# Altium schematic sheet MCU.SchDoc
size A; SheetNumber: 2; SheetTotal: 5
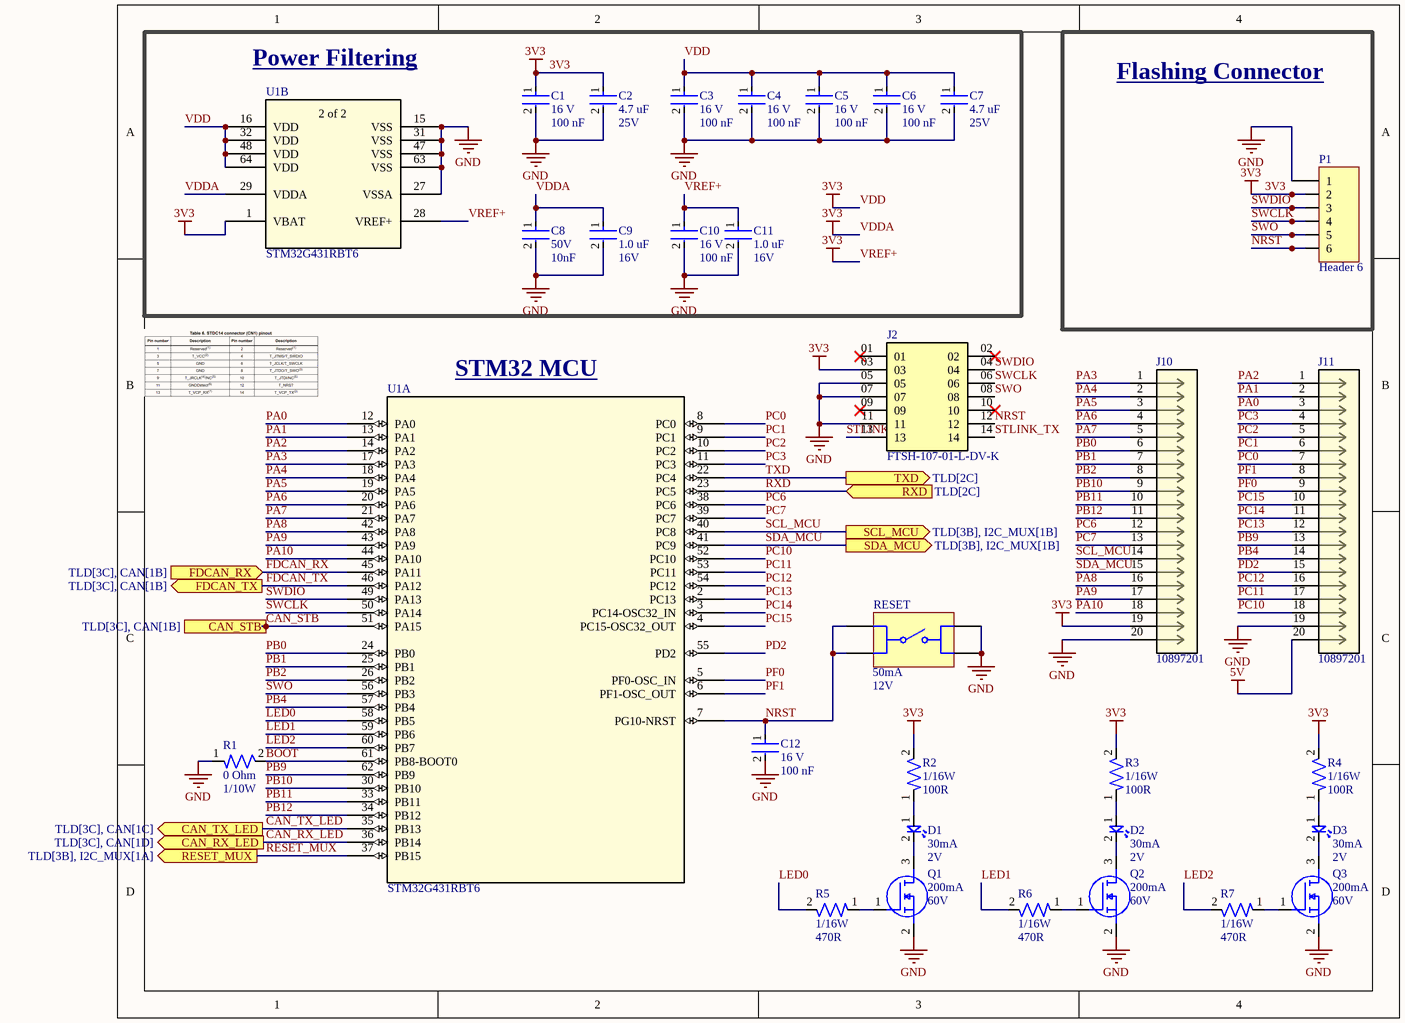
[diagram p0: MCU.SchDoc]

## Parts
C1  Voltage Rating: 16 V  Capacitance: 100 nF  [CAP-0402]  (hidden comment: CC0402KRX7R7BB104)
C2  Capacitance: 4.7 uF  Voltage: 25V  [CAP-0603]  (hidden comment: CC0603KRX5R8BB475)
C3  Voltage Rating: 16 V  Capacitance: 100 nF  [CAP-0402]  (hidden comment: CC0402KRX7R7BB104)
C4  Voltage Rating: 16 V  Capacitance: 100 nF  [CAP-0402]  (hidden comment: CC0402KRX7R7BB104)
C5  Voltage Rating: 16 V  Capacitance: 100 nF  [CAP-0402]  (hidden comment: CC0402KRX7R7BB104)
C6  Voltage Rating: 16 V  Capacitance: 100 nF  [CAP-0402]  (hidden comment: CC0402KRX7R7BB104)
C7  Capacitance: 4.7 uF  Voltage: 25V  [CAP-0603]  (hidden comment: CC0603KRX5R8BB475)
C8  Voltage: 50V  Capacitance: 10nF  [CAP-0805]  (hidden comment: GRM2195C1H103JA01D)
C9  Capacitance: 1.0 uF  Voltage: 16V  [CAP-0603]  (hidden comment: CC0603KRX7R7BB105)
C10  Voltage Rating: 16 V  Capacitance: 100 nF  [CAP-0402]  (hidden comment: CC0402KRX7R7BB104)
C11  Capacitance: 1.0 uF  Voltage: 16V  [CAP-0603]  (hidden comment: CC0603KRX7R7BB105)
C12  Voltage Rating: 16 V  Capacitance: 100 nF  [CAP-0402]  (hidden comment: CC0402KRX7R7BB104)
D1  Forward Current: 30mA  Forward Voltage: 2V  [LED-0603]  (hidden comment: BL-HKC36G-AV-TRB)
D2  Forward Current: 30mA  Forward Voltage: 2V  [LED-0603]  (hidden comment: BL-HKC36G-AV-TRB)
D3  Forward Current: 30mA  Forward Voltage: 2V  [LED-0603]  (hidden comment: BL-HKC36G-AV-TRB)
J2  FTSH-107-01-L-DV-K  [SAMTEC_FTSH-107-01-L-DV-K]
J10  10897201  [CONN20_0010897201_MOL]
J11  10897201  [CONN20_0010897201_MOL]
P1  Header 6  [HDR1X6]
Q1  Continuous Current: 200mA  Voltage: 60V  [IC-SOT23-3]  (hidden comment: T2N7002AK,LM)
Q2  Continuous Current: 200mA  Voltage: 60V  [IC-SOT23-3]  (hidden comment: T2N7002AK,LM)
Q3  Continuous Current: 200mA  Voltage: 60V  [IC-SOT23-3]  (hidden comment: T2N7002AK,LM)
R1  Resistance: 0 Ohm  Power: 1/10W  [RESC1607X60N]  (hidden comment: RESC1607X60N)
R2  Power: 1/16W  Resistance: 100R  [RES-0402]  (hidden comment: RC0402FR-07100RL)
R3  Power: 1/16W  Resistance: 100R  [RES-0402]  (hidden comment: RC0402FR-07100RL)
R4  Power: 1/16W  Resistance: 100R  [RES-0402]  (hidden comment: RC0402FR-07100RL)
R5  Power: 1/16W  Resistance: 470R  [RES-0402]  (hidden comment: RC0402FR-07470RL)
R6  Power: 1/16W  Resistance: 470R  [RES-0402]  (hidden comment: RC0402FR-07470RL)
R7  Power: 1/16W  Resistance: 470R  [RES-0402]  (hidden comment: RC0402FR-07470RL)
RESET  Rated Current: 50mA  Rated Voltage (DC): 12V  [430182095816]  (hidden comment: 430182095816)
U1  STM32G431RBT6  [LQFP64-10x10mm]  (parts A,B of 2)

## Blocks framed on the sheet
Power Filtering: C1-C11 U1
Flashing Connector: P1

## Ports
CAN_RX_LED (out, see TLD[3C], CAN[1D]), CAN_STB (out, see TLD[3C], CAN[1B]), CAN_TX_LED (out, see TLD[3C], CAN[1C]), FDCAN_RX (in, see TLD[3C], CAN[1B]), FDCAN_TX (out, see TLD[3C], CAN[1B]), RESET_MUX (out, see TLD[3B], I2C_MUX[1A]), RXD (in, see TLD[2C]), SCL_MCU (out, see TLD[3B], I2C_MUX[1B]), SDA_MCU (out, see TLD[3B], I2C_MUX[1B]), TXD (out, see TLD[2C])

## Nets
3V3: C1.1 C2.1 C3.1 C4.1 C5.1 C6.1 C7.1 C8.1 C9.1 C10.1 C11.1 J2.03 J10.19 P1.2 R2.2 R3.2 R4.2 U1.1(VBAT) U1.16(VDD) U1.28(VREF+) U1.29(VDDA) U1.32(VDD) U1.48(VDD) U1.64(VDD)  [also labelled VDD, VDDA, VREF+]
5V: J11.20
GND: C1.2 C2.2 C3.2 C4.2 C5.2 C6.2 C7.2 C8.2 C9.2 C10.2 C11.2 C12.2 J2.05 J2.07 J2.11 J10.20 J11.19 P1.1 Q1.2(S) Q2.2(S) Q3.2(S) R1.1 RESET.B1 RESET.B2 U1.15(VSS) U1.27(VSSA) U1.31(VSS) U1.47(VSS) U1.63(VSS)
BOOT: R1.2 U1.61(PB8-BOOT0)
CAN_RX_LED: U1.36(PB14) ; port CAN_RX_LED
CAN_STB: U1.51(PA15) ; port CAN_STB
CAN_TX_LED: U1.35(PB13) ; port CAN_TX_LED
FDCAN_RX: U1.45(PA11) ; port FDCAN_RX
FDCAN_TX: U1.46(PA12) ; port FDCAN_TX
LED0: R5.2 U1.58(PB5)
LED1: R6.2 U1.59(PB6)
LED2: R7.2 U1.60(PB7)
NRST: C12.1 J2.12 P1.6 RESET.A1 RESET.A2 U1.7(PG10-NRST)
PA0: J11.3 U1.12(PA0)
PA1: J11.2 U1.13(PA1)
PA2: J11.1 U1.14(PA2)
PA3: J10.1 U1.17(PA3)
PA4: J10.2 U1.18(PA4)
PA5: J10.3 U1.19(PA5)
PA6: J10.4 U1.20(PA6)
PA7: J10.5 U1.21(PA7)
PA8: J10.16 U1.42(PA8)
PA9: J10.17 U1.43(PA9)
PA10: J10.18 U1.44(PA10)
PB0: J10.6 U1.24(PB0)
PB1: J10.7 U1.25(PB1)
PB2: J10.8 U1.26(PB2)
PB4: J11.14 U1.57(PB4)
PB9: J11.13 U1.62(PB9)
PB10: J10.9 U1.30(PB10)
PB11: J10.10 U1.33(PB11)
PB12: J10.11 U1.34(PB12)
PC0: J11.7 U1.8(PC0)
PC1: J11.6 U1.9(PC1)
PC2: J11.5 U1.10(PC2)
PC3: J11.4 U1.11(PC3)
PC6: J10.12 U1.38(PC6)
PC7: J10.13 U1.39(PC7)
PC10: J11.18 U1.52(PC10)
PC11: J11.17 U1.53(PC11)
PC12: J11.16 U1.54(PC12)
PC13: J11.12 U1.2(PC13)
PC14: J11.11 U1.3(PC14-OSC32_IN)
PC15: J11.10 U1.4(PC15-OSC32_OUT)
PD2: J11.15 U1.55(PD2)
PF0: J11.9 U1.5(PF0-OSC_IN)
PF1: J11.8 U1.6(PF1-OSC_OUT)
RESET_MUX: U1.37(PB15) ; port RESET_MUX
RXD: U1.23(PC5) ; port RXD
SCL_MCU: J10.14 U1.40(PC8) ; port SCL_MCU
SDA_MCU: J10.15 U1.41(PC9) ; port SDA_MCU
STLINK_RX: J2.13
STLINK_TX: J2.14
SWCLK: J2.06 P1.4 U1.50(PA14)
SWDIO: J2.04 P1.3 U1.49(PA13)
SWO: J2.08 P1.5 U1.56(PB3)
TXD: U1.22(PC4) ; port TXD
NetD1_1: D1.1 R2.1
NetD1_2: D1.2 Q1.3(D)
NetD2_1: D2.1 R3.1
NetD2_2: D2.2 Q2.3(D)
NetD3_1: D3.1 R4.1
NetD3_2: D3.2 Q3.3(D)
NetQ1_1: Q1.1(G) R5.1
NetQ2_1: Q2.1(G) R6.1
NetQ3_1: Q3.1(G) R7.1

Not connected (* = marked no-connect by the designer): J2 01* 02* 09* 10*

## Notes on the sheet
- (near U1) STM32 MCU
- (in symbol IC-STM32G431RBT6, part B) 2 of 2

## Library data of the parts
C1 C3-C6 C10 C12 = CAP-0.1U-0001: CAP CER 0.1UF 16V X7R 0402; ComponentLink2Description: Datasheet; ComponentLink2URL: https://www.yageo.com/upload/media/product/productsearch/datasheet/mlcc/UPY-GPHC_X7R_6.3V-to-250V_24.pdf; Device Class: Ceramic; Size: 0402
C2 C7 = CAP-4.7U-0001: CAP CER 4.7UF 25V X5R 0603; Device Class: Ceramic; Size: 0603
C8 = CAP-10N-0001: CAP CER 10000PF 50V C0G/NP0 0805; Device Class: Ceramic; Size: 0805; ComponentLink1Description: Datasheet; ComponentLink1URL: https://search.murata.co.jp/Ceramy/image/img/A01X/G101/ENG/GRM2195C1H103JA01-01.pdf
C9 C11 = CAP-1U-0002: CAP CER 1UF 16V X7R 0603; Device Class: Ceramic; Size: 0603
D1-D3 = LED-0001: LED YELLOW CLEAR 0603 SMD; ComponentLink1Description: Datasheet; ComponentLink1URL: https://www.americanbrightled.com/pdffiles/led-components/smt/BL-HKC36G-AV-TRB.pdf
J2 = CONN_Flashing-0001: Connector Header Surface Mount 14 position 0.050" (1.27mm); MF: Samtec; Value: *; Price: None; Package: None; Availability: Unavailable; MP: FTSH-107-01-L-DV-K; ComponentLink1Description: Datasheet; ComponentLink1URL: https://mm.digikey.com/Volume0/opasdata/d220001/medias/docus/6209/ftsh-1xx-xx-xxx-dv-xxx-xxx-x-xx-mkt.pdf
J10 J11 = CONN-20: 2.54mm Pitch C-Grid Breakaway Header, Dual Row, Vertical, High Temperature, 20 Circuits, Tin (Sn) Plating, 2.72mm PC Tail Length; Manufacturer_Name: Molex Connector Corporation; Copyright: Copyright (C) 2025 Ultra Librarian. All rights reserved.; Manufacturer_Part_Number: 10897201; Datasheet: https://www.molex.com/en-us/products/part-detail-pdf/10897201?display=pdf; RefDes: RefDes; Type: Type
P1 = Header 6: Header, 6-Pin; LatestRevisionDate: 17-Jul-2002; LatestRevisionNote: Re-released for DXP Platform.; Publisher: Altium Limited
Q1-Q3 = NMOS-200MA-0001: MOSFET N-CH 60V 200MA SOT23; ComponentLink1Description: Datasheet; ComponentLink1URL: https://toshiba.semicon-storage.com/info/T2N7002AK_datasheet_en_20150401.pdf?did=29712&prodName=T2N7002AK
R1 = RES-0-0003: 0 Ohms Jumper Chip Resistor 0603 (1608 Metric) Moisture Resistant Thick Film; assembled?: yes; JLC part number: C106231
R2-R4 = RES-100-0001: RES 100 OHM 1% 1/16W 0402; Tolerance: 1%; Size: 0402; ComponentLink1Description: Datasheet; ComponentLink1URL: https://www.yageo.com/upload/media/product/products/datasheet/rchip/PYu-RC_Group_51_RoHS_L_12.pdf
R5-R7 = RES-470-0001: RES 470 OHM 1% 1/16W 0402; Tolerance: 1%; Size: 0402; ComponentLink1Description: Datasheet; ComponentLink1URL: https://www.yageo.com/upload/media/product/products/datasheet/rchip/PYu-RC_Group_51_RoHS_L_12.pdf
RESET = BUTTON-VERT-12V-0.5A: WS-TASV SMT Tact Switch, 6mm x 6mm, 160gf, SPST-NO, 12V, 50mA; Manufacturer: Wurth Elektronik; Washable: No; Manufacturer Part Number: 430182095816; Category: Tact Switch; Match Code: WS-TASV; ComponentLink1Description: Website Link; ComponentLink1URL: https://www.we-online.com/redexpert/article/430182095816?ad; ComponentLink2Description: Datasheet Link; ComponentLink2URL: https://www.we-online.com/redexpert/spec/430182095816?ad; Mount: Surface Mount; Min Operating Temperature: -40°C; Max Operating Temperature: 85°C; Packaging: Tape and Reel; Length: 6mm; Width: 6mm; Height: 9.5mm; Circuit: SPST-NO; Contact Material: Stainless Steel; Contact Plating: Silver; Operation Force: 160gf; Terminal Material: Copper Alloy; Terminal Plating: Silver
U1 = IC-STM32G431RBT6: Mainstream Arm Cortex-M4 MCU 170 MHz with 128 Kbytes of Flash memory, Math Accelerator, Medium Analog level integration; Manufacturer_Name: STMicroelectronics; Copyright: Copyright (C) 2025 Ultra Librarian. All rights reserved.; Manufacturer_Part_Number: STM32G431RBT6; Datasheet: https://www.st.com/resource/en/datasheet/stm32g431c6.pdf; RefDes: RefDes; Type: Type